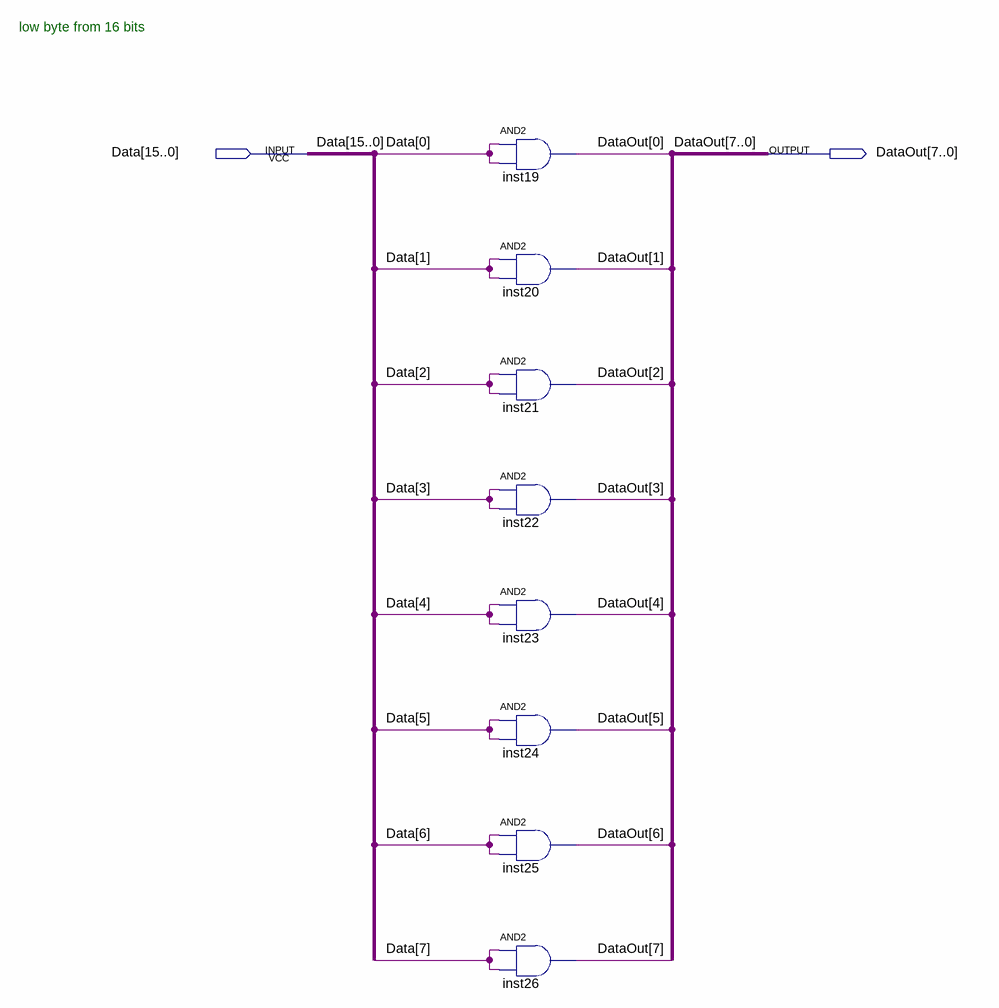
[diagram p0: schematic sheet]
// Quartus schematic 16to8.bdf as structural Verilog: 8 symbols, 2 pins
module \16to8  (
  input  [15:0] Data,
  output [7:0] DataOut
);

  and inst19 (DataOut[0], Data[0], Data[0]);
  and inst20 (DataOut[1], Data[1], Data[1]);
  and inst21 (DataOut[2], Data[2], Data[2]);
  and inst22 (DataOut[3], Data[3], Data[3]);
  and inst23 (DataOut[4], Data[4], Data[4]);
  and inst24 (DataOut[5], Data[5], Data[5]);
  and inst25 (DataOut[6], Data[6], Data[6]);
  and inst26 (DataOut[7], Data[7], Data[7]);

  // Notes on the sheet:
  //   low byte from 16 bits
endmodule
